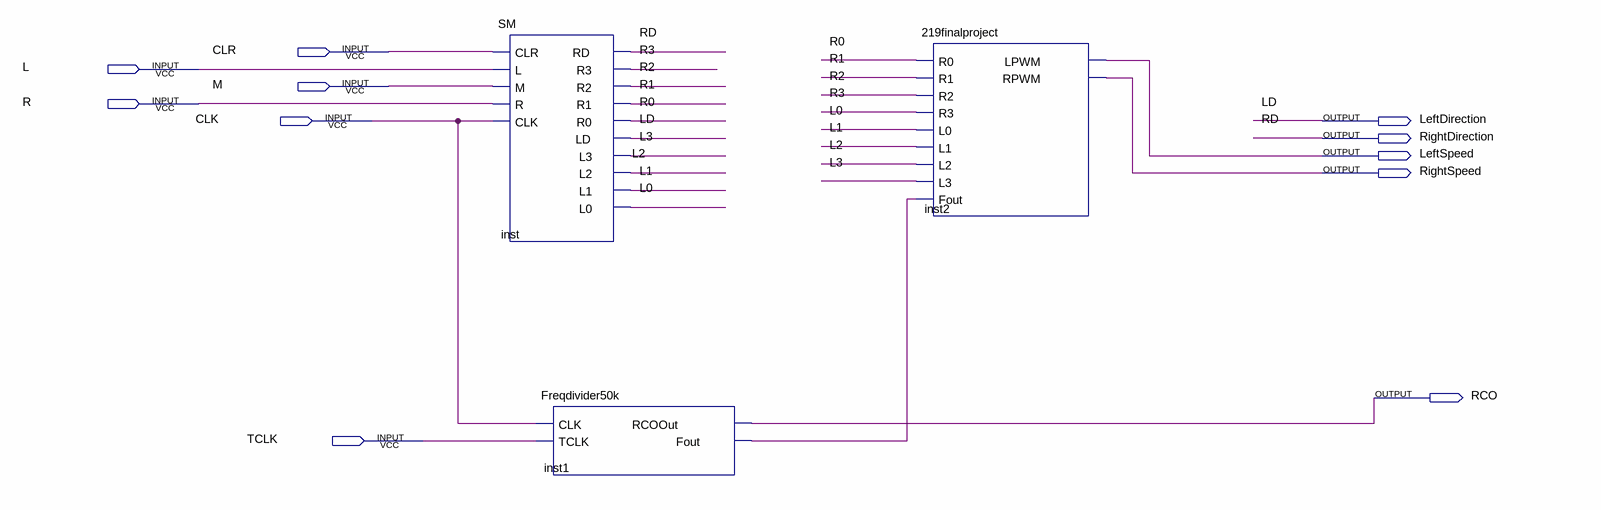
[diagram p0: schematic sheet]
// Quartus schematic RobotProject.bdf as structural Verilog: 3 symbols, 11 pins
module RobotProject (
  input  CLR,
  input  L,
  input  M,
  input  R,
  input  CLK,
  input  TCLK,
  output LeftDirection,
  output RightDirection,
  output LeftSpeed,
  output RightSpeed,
  output RCO
);

  wire inst1_fout, L0, L1, L2, L3, R0, R1, R2, R3;

  SM inst (
    .CLR(CLR), .L(L), .M(M), .R(R), .CLK(CLK), .RD(RightDirection), .R3(R3), .R2(R2), .R1(R1), .R0(R0),
    .LD(LeftDirection), .L3(L3), .L2(L2), .L1(L1), .L0(L0));
  Freqdivider50k inst1 (.CLK(CLK), .TCLK(TCLK), .RCOOut(RCO), .Fout(inst1_fout));
  \219finalproject  inst2 (
    .R0(R0), .R1(R1), .R2(R2), .R3(R3), .L0(L0), .L1(L1), .L2(L2), .L3(L3), .Fout(inst1_fout),
    .LPWM(LeftSpeed), .RPWM(RightSpeed));

  // Other names for the same wires on the sheet: LD = LeftDirection; RD = RightDirection
endmodule
